# EAGLE design teensyLC-midi-IO_02 (EAGLE 7.5.0)
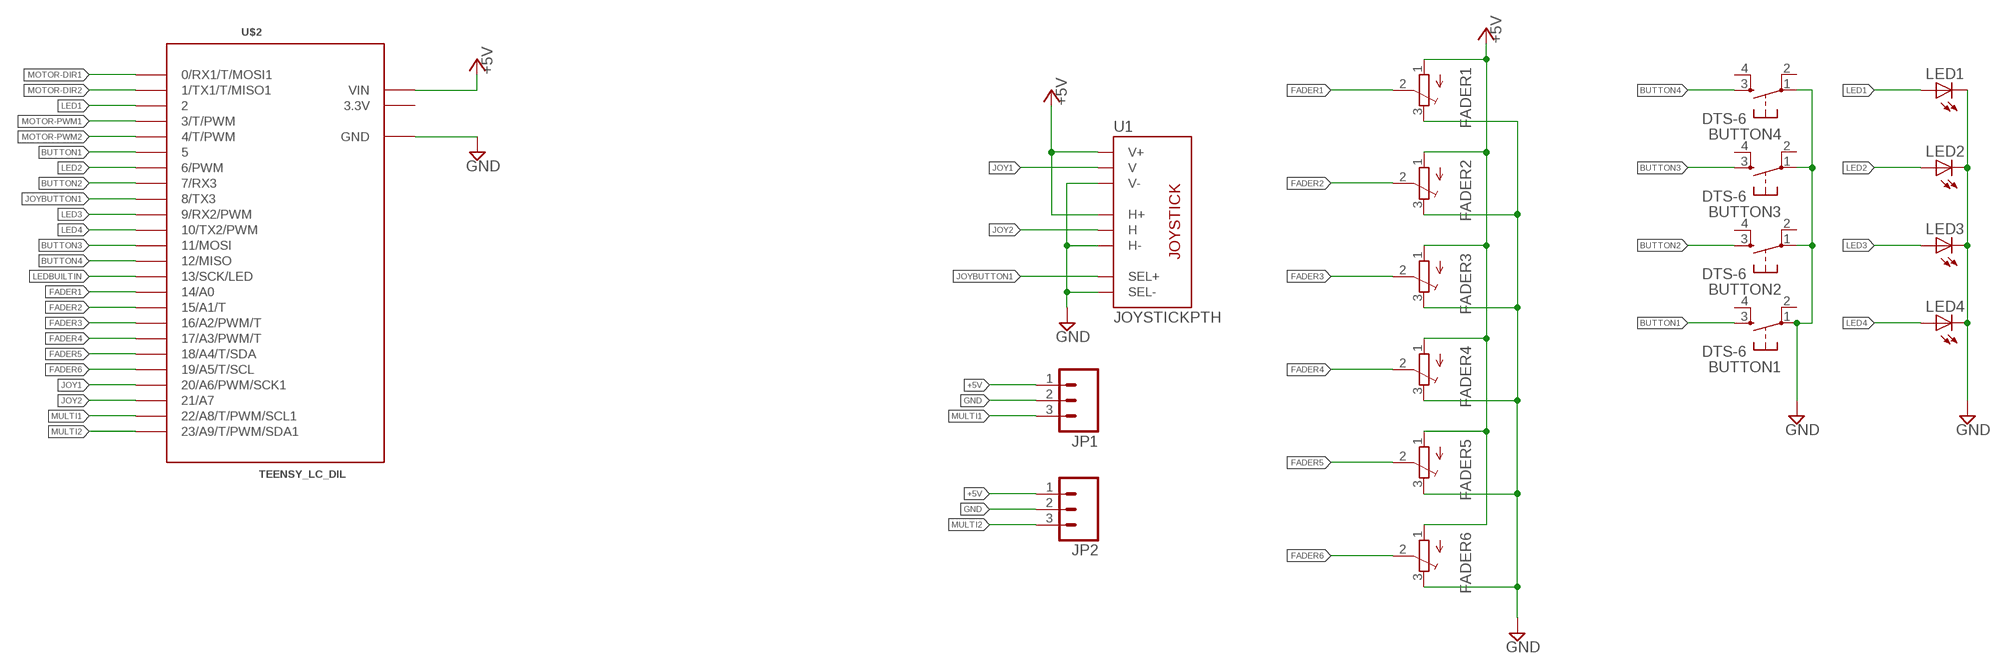
[diagram p0: schematic, sheet 1]

## Parts
BUTTON1  DTS-6  [DTS-6]
BUTTON2  DTS-6  [DTS-6]
BUTTON3  DTS-6  [DTS-6]
BUTTON4  DTS-6  [DTS-6]
FADER1  TRIMPOT3386  [TRIM-3386]
FADER2  TRIMPOT3386  [TRIM-3386]
FADER3  TRIMPOT3386  [TRIM-3386]
FADER4  TRIMPOT3386  [TRIM-3386]
FADER5  TRIMPOT3386  [TRIM-3386]
FADER6  TRIMPOT3386  [TRIM-3386]
JP1  M03LOCK  [1X03_LOCK]
JP2  M03LOCK  [1X03_LOCK]
LED1  LED5MM  [LED5MM]
LED2  LED5MM  [LED5MM]
LED3  LED5MM  [LED5MM]
LED4  LED5MM  [LED5MM]
U1  JOYSTICKPTH  [JOYSTICK]
U$2  TEENSY_LC_DIL  [TEENSY_3.0-3.2&LC_DIL]

## Nets
+5V [Power]: FADER1.1(A) FADER2.1(A) FADER3.1(A) FADER4.1(A) FADER5.1(A) FADER6.1(A) JP1.1 JP2.1 U1.H1(H+) U1.V1(V+) U$2.VIN
BUTTON1: BUTTON1.3 U$2.5
BUTTON2: BUTTON2.3 U$2.7(7/RX3)
BUTTON3: BUTTON3.3 U$2.11(11/MOSI)
BUTTON4: BUTTON4.3 U$2.12(12/MISO)
FADER1: FADER1.2(S) U$2.14/A0
FADER2: FADER2.2(S) U$2.15/A1(15/A1/T)
FADER3: FADER3.2(S) U$2.16/A2(16/A2/PWM/T)
FADER4: FADER4.2(S) U$2.17/A3(17/A3/PWM/T)
FADER5: FADER5.2(S) U$2.18/A4(18/A4/T/SDA)
FADER6: FADER6.2(S) U$2.19/A5(19/A5/T/SCL)
GND [GND]: BUTTON1.1 BUTTON2.1 BUTTON3.1 BUTTON4.1 FADER1.3(E) FADER2.3(E) FADER3.3(E) FADER4.3(E) FADER5.3(E) FADER6.3(E) JP1.2 JP2.2 LED1.K(C) LED2.K(C) LED3.K(C) LED4.K(C) U1.B2A(SEL-) U1.H3(H-) U1.V3(V-) U$2.AGND(GND) U$2.GND
JOY1: U1.V2(V) U$2.20/A6(20/A6/PWM/SCK1)
JOY2: U1.H2(H) U$2.21/A7
JOYBUTTON1: U1.B1A(SEL+) U$2.8(8/TX3)
LED1: LED1.A U$2.2
LED2: LED2.A U$2.6(6/PWM)
LED3: LED3.A U$2.9(9/RX2/PWM)
LED4: LED4.A U$2.10(10/TX2/PWM)
LEDBUILTIN: U$2.13(13/SCK/LED)
MOTOR-DIR1: U$2.0(0/RX1/T/MOSI1)
MOTOR-DIR2: U$2.1(1/TX1/T/MISO1)
MOTOR-PWM1: U$2.3(3/T/PWM)
MOTOR-PWM2: U$2.4(4/T/PWM)
MULTI1: JP1.3 U$2.22/A8(22/A8/T/PWM/SCL1)
MULTI2: JP2.3 U$2.23/A9(23/A9/T/PWM/SDA1)
Unconnected: BUTTON1.2 BUTTON1.4 BUTTON2.2 BUTTON2.4 BUTTON3.2 BUTTON3.4 BUTTON4.2 BUTTON4.4

## Power pins joined to a net without a drawn wire
3.3V: U$2.3.3V

## Library data of the parts
BUTTON1-BUTTON4 = switch-tact:DTS-6
FADER1-FADER6 = adafruit:TRIMPOT: SMT trimmer potentiometer part number TC33X http://www.ladyada.net/library/eagle
JP1 JP2 = SparkFun-Connectors:M03: Header 3 Standard 3-pin 0.1" header. Use with straight break away headers (SKU : PRT-00116), right angle break away headers (PRT-00553), swiss pins (PRT-00743), machine pins (PRT-00117), and female headers (PRT-00115). Molex polarized connector foot print use with SKU : PRT-08232 with associated crimp pins and housings.
LED1-LED4 = adafruit:LED: LED OSRAM: - CHIPLED LG R971, LG N971, LY N971, LG Q971, LY Q971, LO R971, LY R971 LH N974, LH R974 LS Q976, LO Q976, LY Q976 LO Q996 - Hyper CHIPLED LW Q18S LB Q993, LB Q99A, LB R99A - SideLED LS A670, LO A670, LY A670, LG A670, LP A670 LB A673, LV A673, LT A673, LW A673 LH A674 LY A675 LS A676, LA A676, LO A676, LY A676, LW A676 LS A679, LY A679, LG A679 - Hyper Micro SIDELED® LS Y876, LA Y876, LO Y876, LY Y876 LT Y87S - SmartLED LW L88C, LW L88S LB L89C, LB L89S, LG L890 LS L89K, LO L89K, LY L89K LS L896, LA L896, LO L896, LY L896 - TOPLED LS T670, LO T670, LY T670, LG T670, LP T670 LSG T670, LSP T670, LSY T670, LOP T670, LYG T670 LG T671, LOG T671, LSG T671 LB T673, LV T673, LT T673, LW T673 LH T674 LS T676, LA T676, LO T676, LY T676, LB T676, LH T676, LSB T676, LW T676 LB T67C, LV T67C, LT T67C, LS T67K, LO T67K, LY T67K, LW E67C LS E67B, LA E67B, LO E67B, LY E67B, LB E67C, LV E67C, LT E67C LW T67C LS T679, LY T679, LG T679 LS T770, LO T770, LY T770, LG T770, LP T770 LB T773, LV T773, LT T773, LW T773 LH T774 LS E675, LA E675, LY E675, LS T675 LS T776, LA T776, LO T776, LY T776, LB T776 LHGB T686 LT T68C, LB T68C - Hyper Mini TOPLED® LB M676 - Mini TOPLED Santana® LG M470 LS M47K, LO M47K, LY M47K Source: http://www.osram.convergy.de/
U1 = adafruit:JOYSTICK: Thumb Joystick Joystick commonly found in PS2 controllers. Two pots and a select switch. Adapted from Sparkfun Library (but for more common 6mm switch sticks)
U$2 = Teensy_3_and_LC_Series_Boards_v1.4:TEENSY_LC_DIL

## Net classes
0 default: width 0.152 mm, clearance 0.152 mm
1 GND: width 0.508 mm, clearance 0.152 mm
2 Power: width 0.508 mm, clearance 0.152 mm

## Board
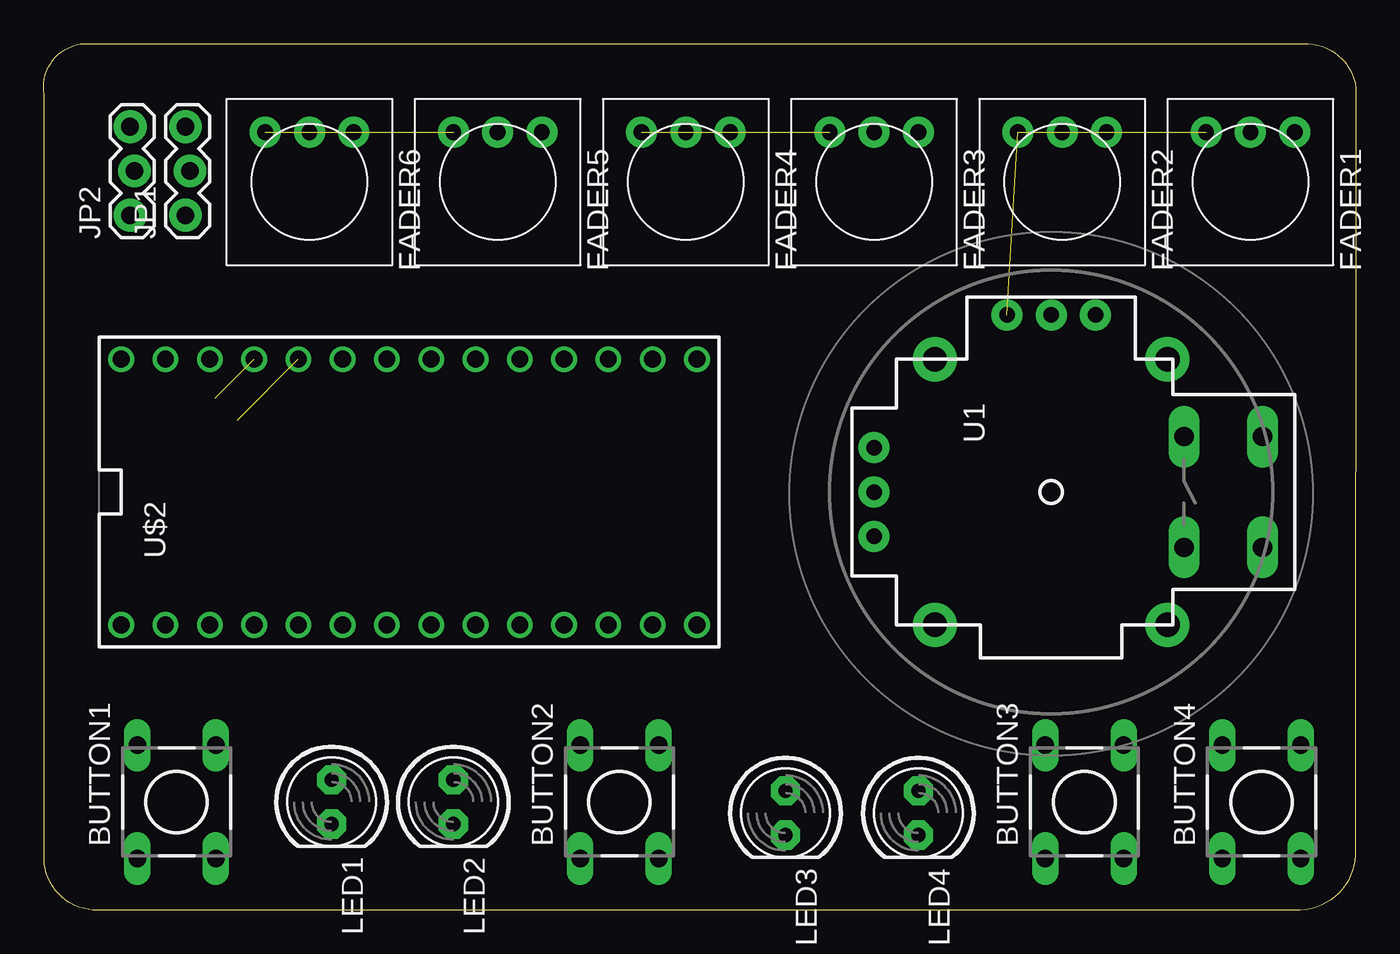
[diagram p1: board, top side]
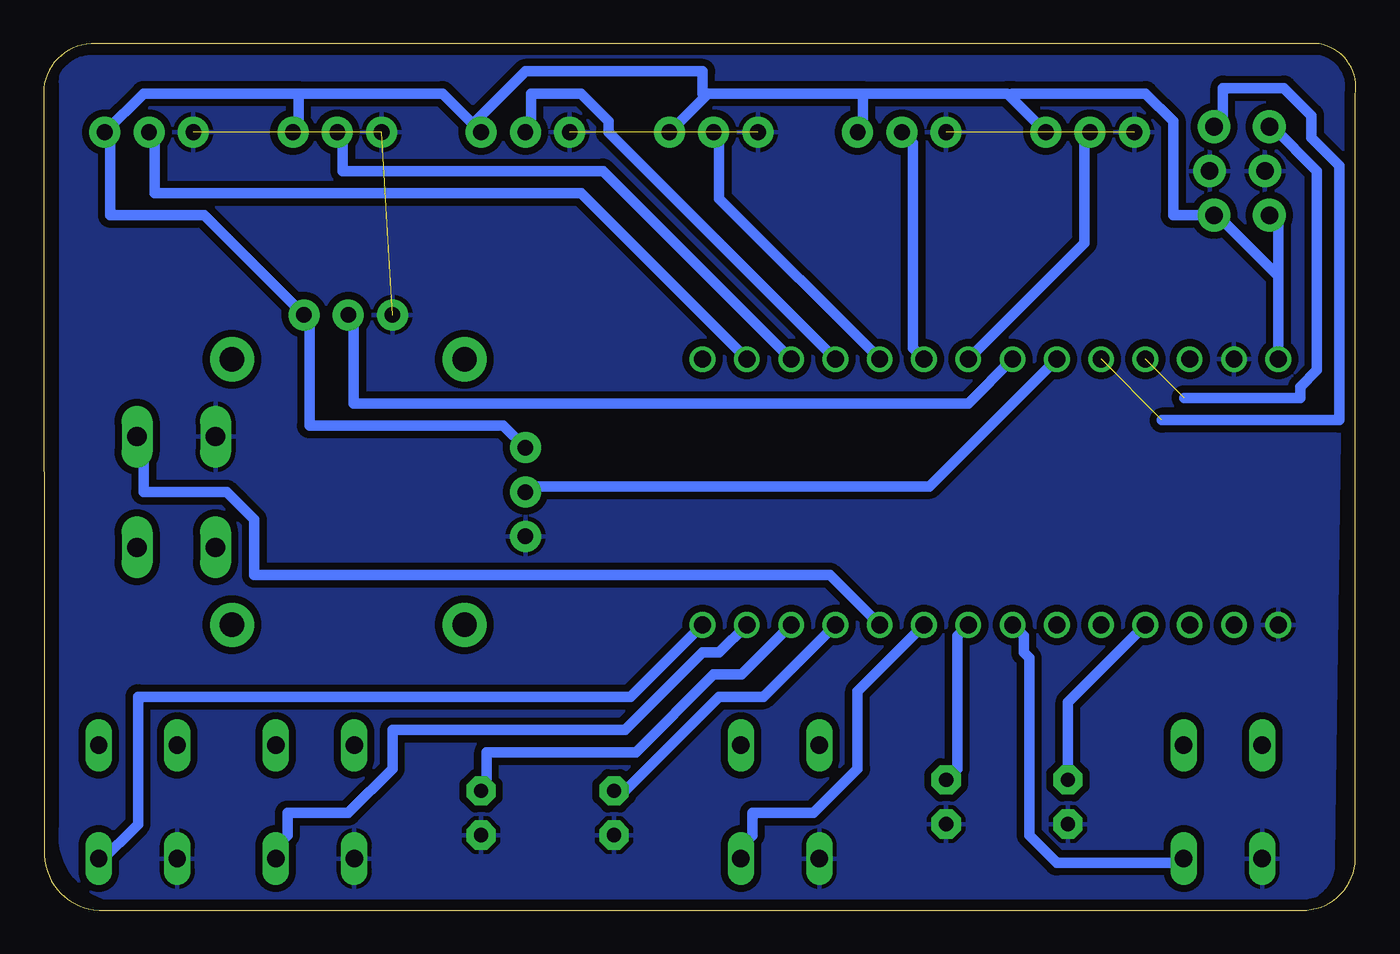
[diagram p2: board, bottom side, seen from below]

Size 75.27 x 49.72 mm. Coordinates in mm from the lower left corner, seen from the top.
Outline: 75.24,3.15 arc-90 71.79,0 2.83,0.01 arc-90 0.04,3.22 0.04,46.79 arc-90 2.09,49.7 72.01,49.7 arc-90 75.27,47.17 75.24,3.15
Copper layers (1*16): Top 0.035mm / dielectric 1.5mm / Bottom 0.035mm
Design rules "default *": minimum track width 24mil, minimum drill 24mil, track to track 16mil, track to pad 16mil, pad to pad 16mil, via to via 6mil, smd to smd 6mil, copper to edge 24mil, drill to drill 24mil, minimum pad ring 10mil, minimum via ring 8mil, stop-mask expansion 4mil, vias tented up to drill 0mil, thermal gap 10mil

### Footprints (pad centres in the part's own frame; a part is rotated, then mirrored left to right if it is on the bottom)
DTS-6 = drill 1 long: 1 -3.25,2.25; 2 3.25,2.25; 3 -3.25,-2.25; 4 3.25,-2.25
TRIM-3386 = drill 0.9 pad 1.778: 1 -2.54,-2.857; 2 0,-2.857; 3 2.54,-2.857
1X03_LOCK = drill 1.016 pad 1.88: 1 0,0.127; 2 2.54,-0.127; 3 5.08,0.127
LED5MM = drill 0.813 pad 1.676 octagon: A -1.27,0; K 1.27,0
JOYSTICK = drill 1.1 pad 1.778 long: B1A -3.175,12.12; B1B 3.175,12.12; B2A -3.175,7.62; B2B 3.175,7.62 | drill 0.889 pad 1.778: H1 -2.54,-10.16; H2 0,-10.16; H3 2.54,-10.16; V1 -10.16,2.54; V2 -10.16,0; V3 -10.16,-2.54 | drill 1.397 pad 2.54: MOUNT1 -7.62,6.668; MOUNT2 -7.62,-6.668; MOUNT3 7.62,-6.668; MOUNT4 7.62,6.668
TEENSY_3.0-3.2&LC_DIL = drill 0.965: 0 -7.62,13.97; 1 -7.62,11.43; 2 -7.62,8.89; 3 -7.62,6.35; 3.3V 7.62,11.43; 4 -7.62,3.81; 5 -7.62,1.27; 6 -7.62,-1.27; 7 -7.62,-3.81; 8 -7.62,-6.35; 9 -7.62,-8.89; 10 -7.62,-11.43; 11 -7.62,-13.97; 12 -7.62,-16.51; 13 7.62,-16.51; 14/A0 7.62,-13.97; 15/A1 7.62,-11.43; 16/A2 7.62,-8.89; 17/A3 7.62,-6.35; 18/A4 7.62,-3.81; 19/A5 7.62,-1.27; 20/A6 7.62,1.27; 21/A7 7.62,3.81; 22/A8 7.62,6.35; 23/A9 7.62,8.89; AGND 7.62,13.97; GND -7.62,16.51; VIN 7.62,16.51

### Placement (x,y rotation side)
BUTTON1  7.63,6.21 90 top
BUTTON2  33.03,6.21 90 top
BUTTON3  59.7,6.21 90 top
BUTTON4  69.86,6.21 90 top
FADER1  69.22,41.77 180 top
FADER2  58.43,41.77 180 top
FADER3  47.63,41.77 180 top
FADER4  36.84,41.77 180 top
FADER5  26.04,41.77 180 top
FADER6  15.25,41.77 180 top
JP1  8.26,39.87 90 top
JP2  5.09,39.87 90 top
LED1  16.52,6.21 270 top
LED2  23.5,6.21 270 top
LED3  42.55,5.58 270 top
LED4  50.17,5.58 270 top
U1  57.79,23.99 270 top
U$2  20.96,23.99 90 top

### Tracks (layer width: path | path; a pad name or v marks a point on that pad's centre or on a via)
+5V
  Bottom 0.61: U1.H1 48.9,27.8 60.02,27.8 60.02,33.83 U1.V1 66.05,39.87 71.44,39.87 71.44,44.63 FADER1.1 69.54,46.85 60.65,46.85 | 60.65,46.85 52.39,46.85 FADER3.1 50.49,45.27 47.63,48.12 37.47,48.12 37.47,46.85 37.31,46.69 | 60.65,46.85 60.65,44.95 FADER2.1 | 4.45,36.38 4.45,39.55 4.77,39.87 JP2.1 | 4.45,36.38 U$2.VIN | 4.45,36.38 7.94,39.87 JP1.1 10.49,39.87 10.49,45.27 12.07,46.85 19.69,46.85 19.85,46.69 | 19.85,46.69 20.01,46.85 28.26,46.85 | 19.85,46.69 FADER6.1 | 28.26,46.85 28.26,44.95 FADER5.1 | 37.31,46.69 37.15,46.85 28.26,46.85 | 37.31,46.69 FADER4.1
BUTTON1
  Bottom 0.61: U$2.5 19.06,15.74 19.06,14.78 18.74,14.47 18.74,4.31 17.15,2.72 10.17,2.72 BUTTON1.3
BUTTON2
  Bottom 0.61: U$2.7 28.58,12.56 28.58,8.12 31.12,5.58 34.61,5.58 34.61,4.31 35.25,3.67 35.25,3.04 BUTTON2.3
BUTTON3
  Bottom 0.61: U$2.11 36.52,14.78 37.47,14.78 41.92,10.34 55.25,10.34 55.25,8.12 57.79,5.58 61.28,5.58 61.28,4.31 61.92,3.67 61.92,3.04 BUTTON3.3
BUTTON4
  Bottom 0.61: U$2.12 41.6,12.25 69.86,12.25 69.86,4.94 72.08,2.72 BUTTON4.3
FADER1
  Bottom 0.61: U$2.14/A0 44.46,41.14 68.91,41.14 68.91,44.31 FADER1.2
FADER2
  Bottom 0.61: U$2.15/A1 43.19,42.41 58.11,42.41 58.11,44.31 FADER2.2
FADER3
  Bottom 0.61: U$2.16/A2 42.87,44.63 42.87,45.27 44.46,46.85 47.32,46.85 47.32,44.95 FADER3.2
FADER4
  Bottom 0.61: U$2.17/A3 36.52,40.82 36.52,44.31 FADER4.2
FADER5
  Bottom 0.61: U$2.18/A4 25.41,32.25 25.41,44 FADER5.2
FADER6
  Bottom 0.61: U$2.19/A5 15.57,38.28 15.57,44.31 FADER6.2
GND  (4 unrouted)
  pour Bottom: 0.64,47.23 1.28,3.04 arc90 3.18,0.5 71.13,0.5 arc90 74.3,4.94 74.3,47.23 arc90 73.03,49.14 2.55,49.14 arc90
JOY1
  Bottom 0.61: U$2.20/A6 22.23,29.07 57.47,29.07 57.47,33.83 U1.V2
JOY2
  Bottom 0.61: U$2.21/A7 24.46,24.31 47.63,24.31 U1.H2
JOYBUTTON1
  Bottom 0.61: U$2.8 30.17,19.23 63.19,19.23 63.19,22.41 64.78,23.99 69.54,23.99 69.54,26.85 69.86,27.17 U1.B1A
LED1
  Bottom 0.61: U$2.2 16.52,11.93 LED1.A
LED2
  Bottom 0.61: U$2.6 22.87,15.74 22.87,8.12 LED2.A
LED3
  Bottom 0.61: U$2.9 33.98,12.25 36.52,12.25 41.92,6.85 LED3.A
LED4
  Bottom 0.61: U$2.10 35.25,13.51 36.84,13.51 41.28,9.07 49.85,9.07 49.85,7.17 LED4.A
MULTI1  (1 unrouted)
  Bottom 0.61: 11.12,28.12 0.96,28.12 0.96,42.72 2.55,44.31 2.55,45.58 4.13,47.17 7.63,47.17 7.63,45.27 7.94,44.95 JP1.3
MULTI2  (1 unrouted)
  Bottom 0.61: 9.85,29.39 3.18,29.39 3.18,30.03 2.23,30.98 2.23,42.41 4.77,44.95 JP2.3